# Altium schematic sheet CON_BATT_COIN.SchDoc: Lithium Battery Holder - CR2032
size A4; Organization: Altium Limited.; SheetNumber: 1; SheetTotal: 100
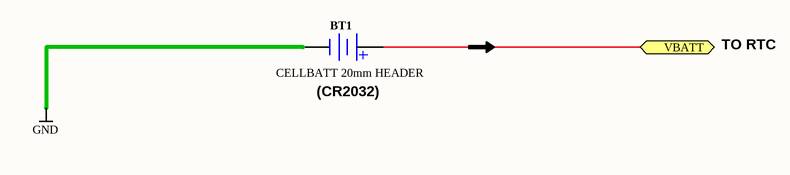
[diagram p0: CON_BATT_COIN.SchDoc]

## Parts
BT1  CELLBATT 20mm HEADER  [CELL_HOLDER]

## Ports
VBATT

## Nets
GND: BT1.2(-)
VBATT: BT1.1(+) ; port VBATT

## Notes on the sheet
- TO RTC
- (near BT1) (CR2032)
- Sheet Title
- Project Title
- Size:
- Date:
- A4
- Assy:
- Time:
- Revision:
- Sheet
- of
- File:

## Library data of the parts
BT1 = D-302-0000: Lithium Battery Holder for CR2032 3V Cell; Category: Battery; Mounting Technology: Through-Hole; Nominal output Voltage: 3 V; Status: Production